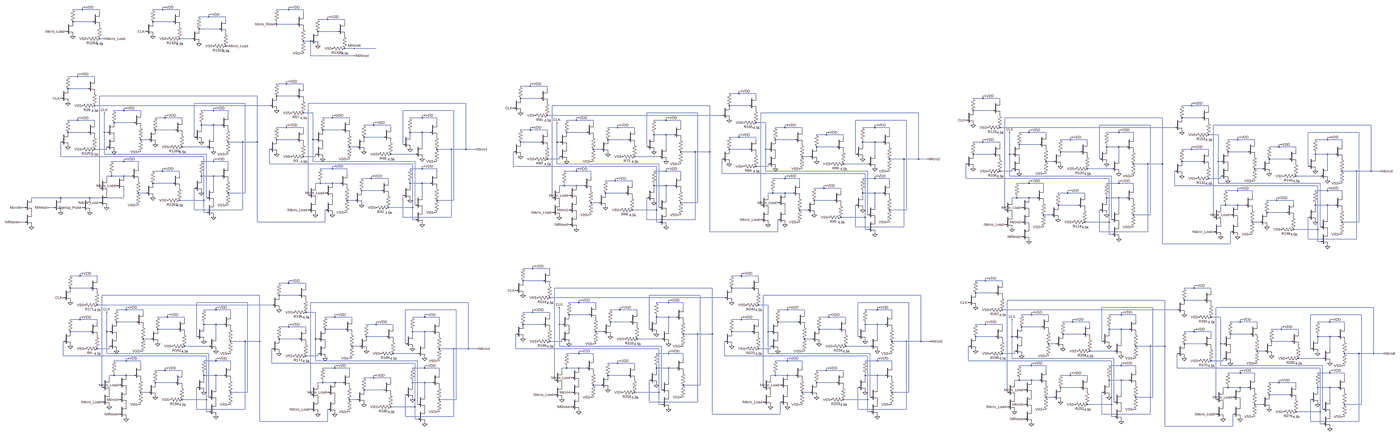
[diagram p0: schematic step_counter.asc, whole sheet]
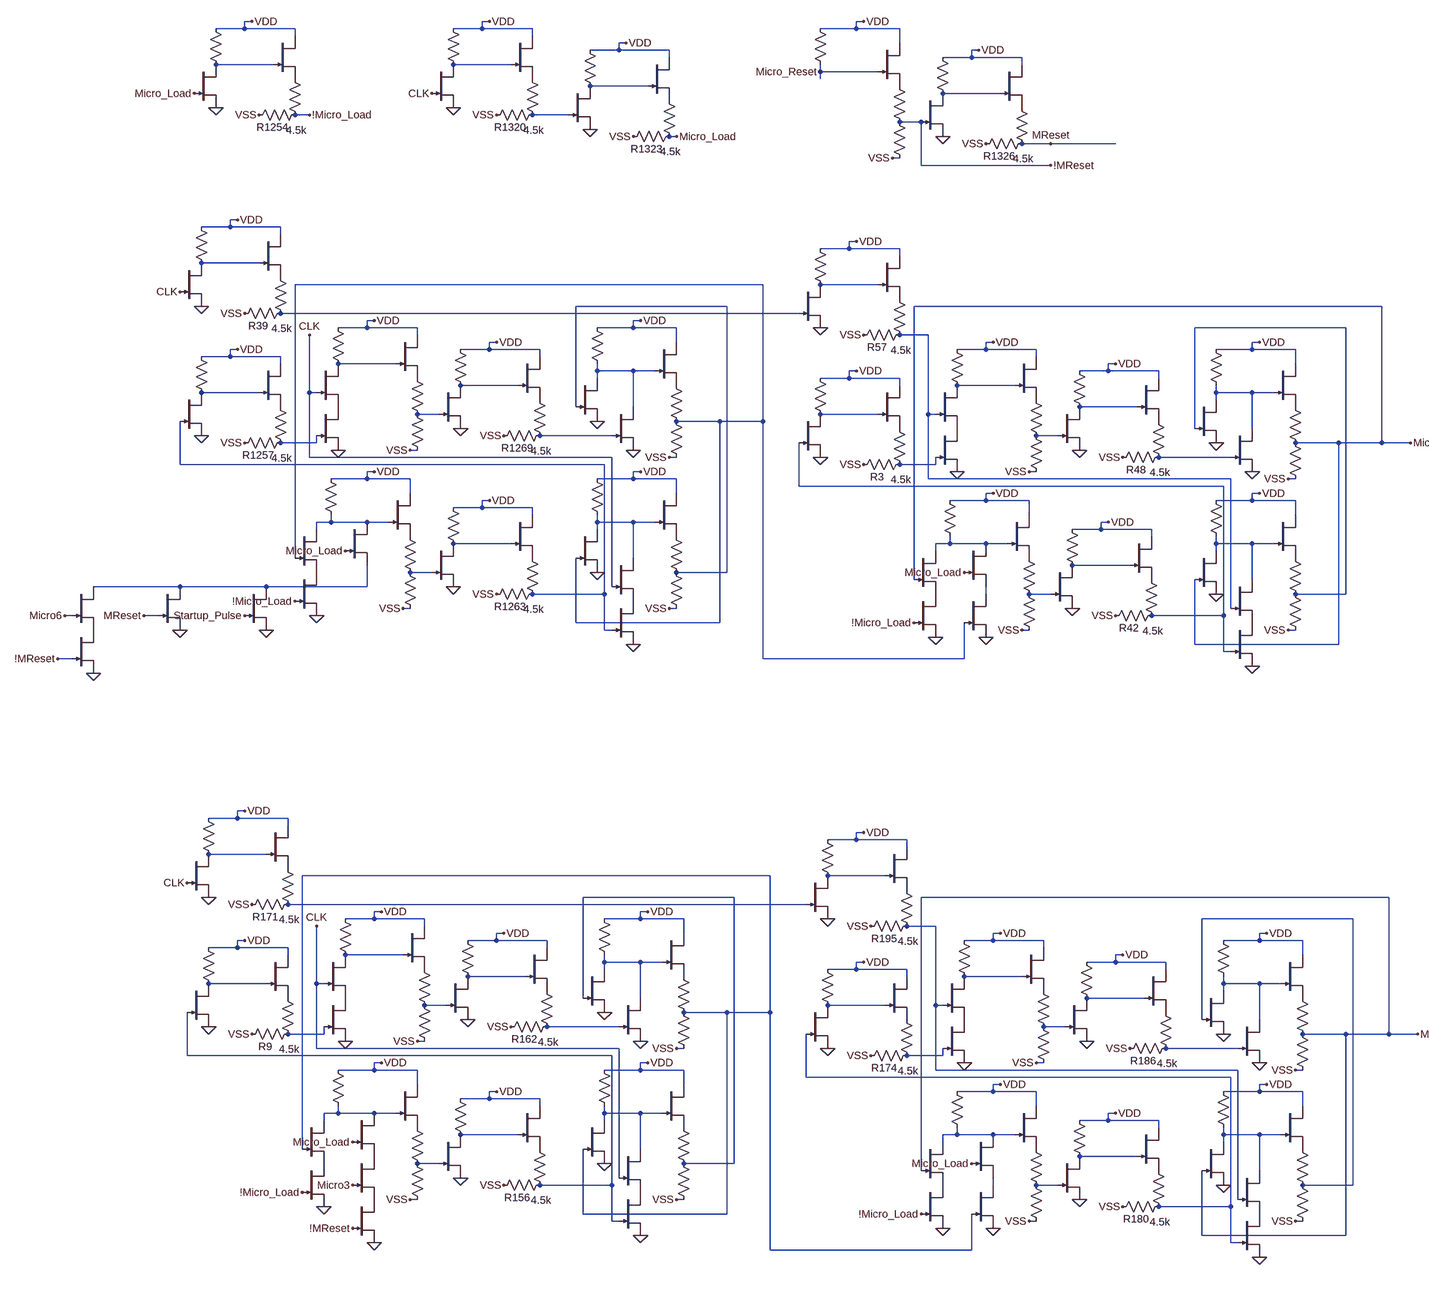
[diagram p1: schematic step_counter.asc, part, row 1 of 1, column 1 of 3]
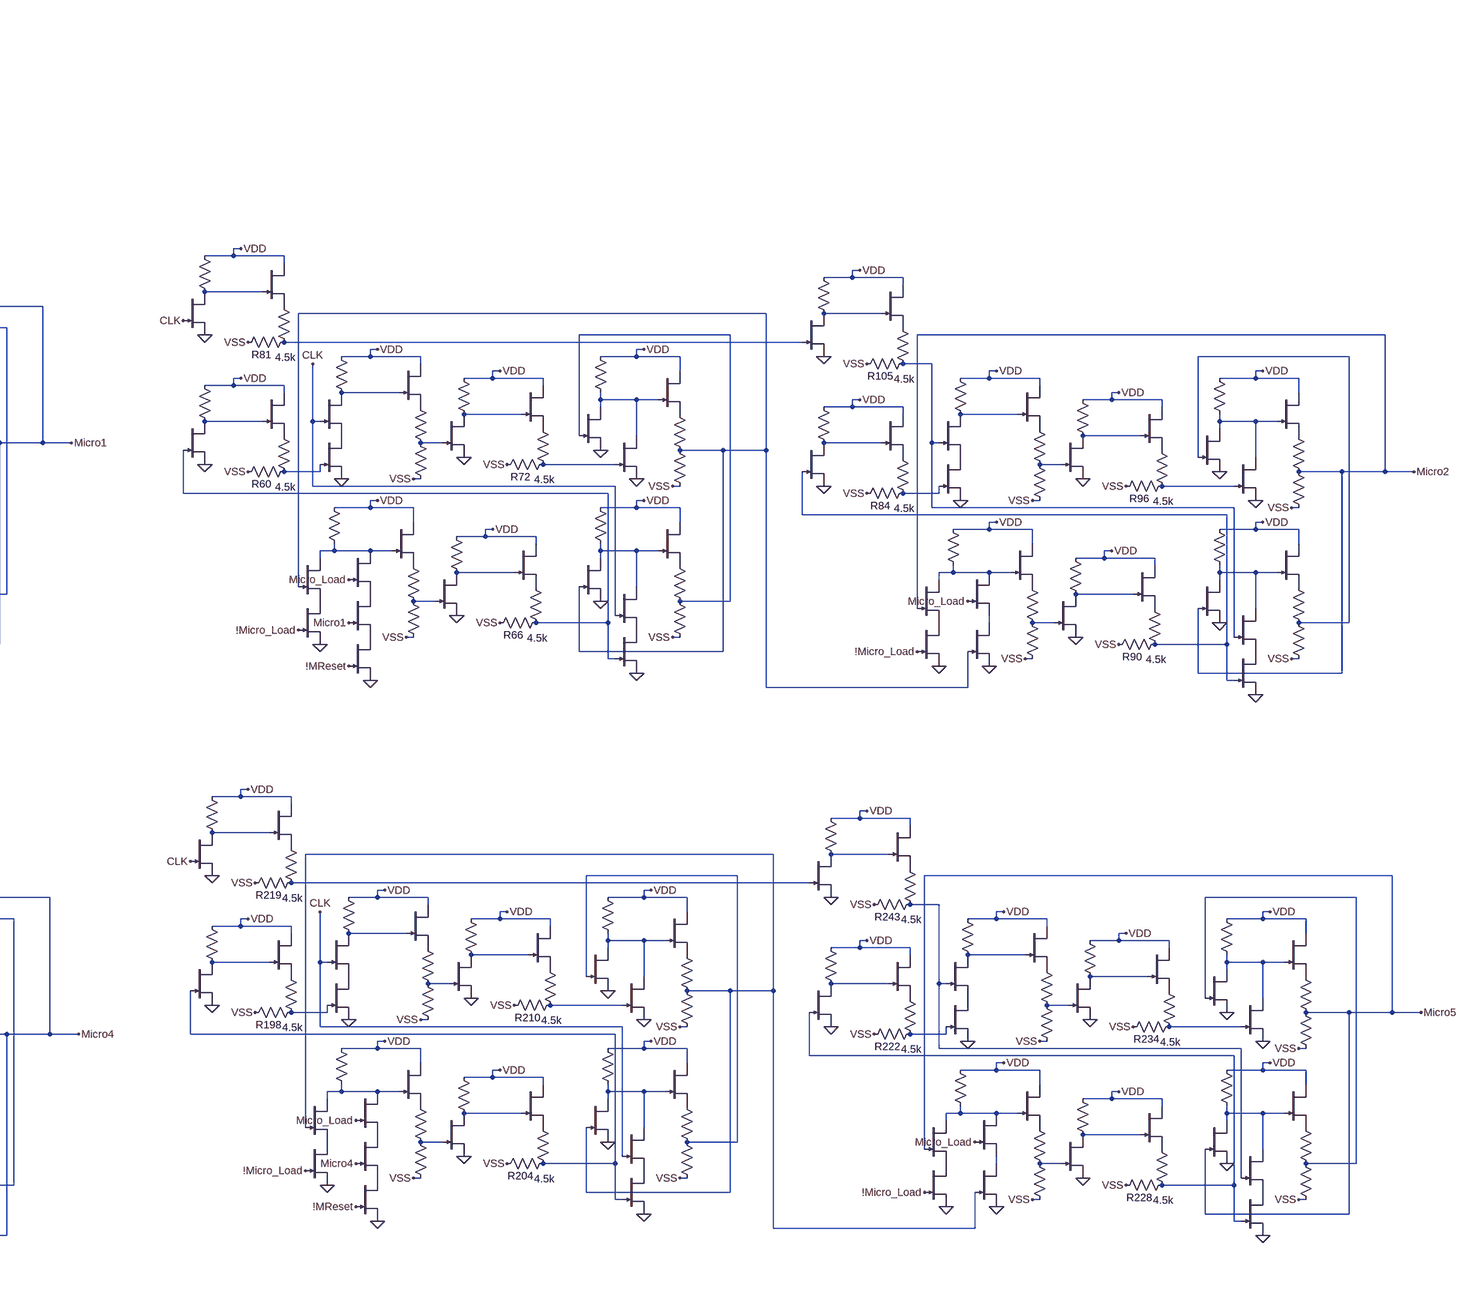
[diagram p2: schematic step_counter.asc, part, row 1 of 1, column 2 of 3]
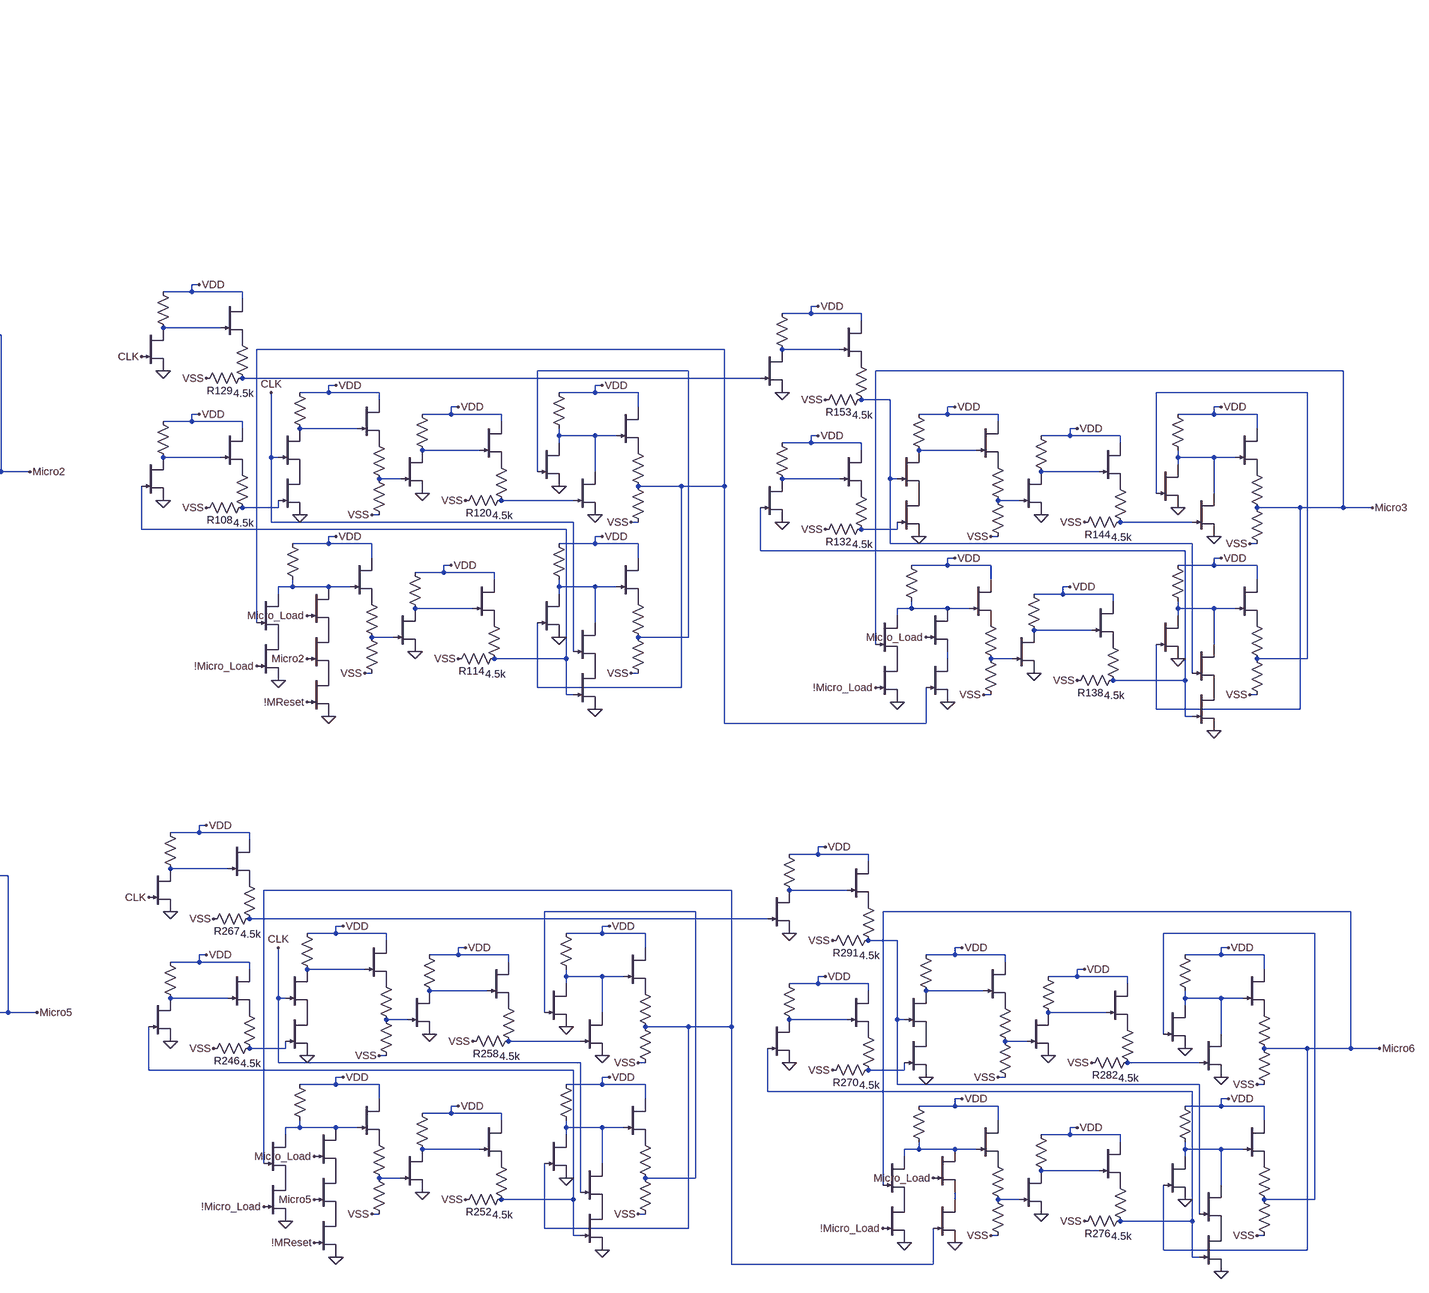
[diagram p3: schematic step_counter.asc, part, row 1 of 1, column 3 of 3]
* step_counter.asc
R1249 VDD Micro_Reset 100k
J_F313 VDD Micro_Reset P001 DR
R1250 P001 !MReset 1k
R1251 !MReset VSS 4.8k
J_A858 N001 Micro_Load 0 DR
R1252 VDD N001 50k
J_A859 VDD N001 P002 DR
R1253 P002 !Micro_Load 1k
R1254 !Micro_Load VSS 4.5k
J_A860 N071 Micro_Load N087 DR
J_A861 N029 N055 0 DR
R1255 VDD N029 50k
J_A862 VDD N029 P003 DR
R1256 P003 N047 1k
R1257 N047 VSS 4.5k
J_A863 P004 !Micro_Load 0 DR
R1258 VDD N071 100k
J_F314 VDD N071 P005 DR
R1259 P005 N083 1k
R1260 N083 VSS 4.8k
J_A864 N076 N083 0 DR
R1261 VDD N076 50k
J_A865 VDD N076 P006 DR
R1262 P006 N055 1k
R1263 N055 VSS 4.5k
J_A866 N022 CLK P007 DR
R1264 VDD N022 100k
J_F315 VDD N022 P008 DR
R1265 P008 N036 1k
R1266 N036 VSS 4.8k
J_B416 P007 N047 0 DR
J_A867 N027 N036 0 DR
R1267 VDD N027 50k
J_F316 VDD N027 P009 DR
R1268 P009 N043 1k
R1269 N043 VSS 4.5k
J_A868 N024 N010 0 DR
R1270 VDD N024 100k
J_F317 VDD N024 P010 DR
R1271 P010 N007 1k
R1272 N007 VSS 4.8k
J_B417 N024 N043 0 DR
J_A869 N072 N007 0 DR
R1273 VDD N072 100k
J_F318 VDD N072 P011 DR
R1274 P011 N010 1k
R1275 N010 VSS 4.8k
J_B418 N072 CLK P012 DR
J_A870 N071 N007 P004 DR
J_B419 P012 N055 0 DR
J_B420 N087 Startup_Pulse 0 DR
J_A871 N087 Micro6 P013 DR
J_B421 P013 !MReset 0 DR
R1318 VDD N002 50k
J_A895 VDD N002 P014 DR
R1319 P014 N005 1k
R1320 N005 VSS 4.5k
J_F329 N002 CLK 0 DR
R1321 VDD N003 50k
J_A896 VDD N003 P015 DR
R1322 P015 Micro_Load 1k
R1323 Micro_Load VSS 4.5k
J_F330 N003 N005 0 DR
J_B433 N087 MReset 0 DR
R1324 VDD N004 50k
J_A897 VDD N004 P016 DR
R1325 P016 MReset 1k
R1326 MReset VSS 4.5k
J_F331 N004 !MReset 0 DR
J_A13 N006 CLK 0 DR
R37 VDD N006 50k
J_A14 VDD N006 P017 DR
R38 P017 N011 1k
R39 N011 VSS 4.5k
J_A1 N077 Micro_Load N090 DR
J_A2 N037 N063 0 DR
R1 VDD N037 50k
J_A15 VDD N037 P018 DR
R2 P018 N056 1k
R3 N056 VSS 4.5k
J_A16 P019 !Micro_Load 0 DR
R4 VDD N077 100k
J_F1 VDD N077 P020 DR
R5 P020 N091 1k
R6 N091 VSS 4.8k
J_A17 N082 N091 0 DR
R40 VDD N082 50k
J_A18 VDD N082 P021 DR
R41 P021 N063 1k
R42 N063 VSS 4.5k
J_A19 N028 N016 P022 DR
R43 VDD N028 100k
J_F2 VDD N028 P023 DR
R44 P023 N044 1k
R45 N044 VSS 4.8k
J_B1 P022 N056 0 DR
J_A20 N035 N044 0 DR
R46 VDD N035 50k
J_F13 VDD N035 P024 DR
R47 P024 N052 1k
R48 N052 VSS 4.5k
J_A21 N030 N014 0 DR
R49 VDD N030 100k
J_F14 VDD N030 P025 DR
R50 P025 Micro1 1k
R51 Micro1 VSS 4.8k
J_B2 N030 N052 0 DR
J_A22 N078 Micro1 0 DR
R52 VDD N078 100k
J_F15 VDD N078 P026 DR
R53 P026 N014 1k
R54 N014 VSS 4.8k
J_B3 N078 N016 P027 DR
J_A23 N077 Micro1 P019 DR
J_B4 P027 N063 0 DR
J_A24 N008 N011 0 DR
R55 VDD N008 50k
J_A25 VDD N008 P028 DR
R56 P028 N016 1k
R57 N016 VSS 4.5k
J_A26 N090 N007 0 DR
J_A27 N079 Micro_Load P029 DR
J_A28 N040 N065 0 DR
R58 VDD N040 50k
J_A29 VDD N040 P030 DR
R59 P030 N059 1k
R60 N059 VSS 4.5k
J_A30 P031 !Micro_Load 0 DR
R61 VDD N079 100k
J_F16 VDD N079 P032 DR
R62 P032 N093 1k
R63 N093 VSS 4.8k
J_A31 N084 N093 0 DR
R64 VDD N084 50k
J_A32 VDD N084 P033 DR
R65 P033 N065 1k
R66 N065 VSS 4.5k
J_A33 N031 CLK P034 DR
R67 VDD N031 100k
J_F17 VDD N031 P035 DR
R68 P035 N048 1k
R69 N048 VSS 4.8k
J_B5 P034 N059 0 DR
J_A34 N038 N048 0 DR
R70 VDD N038 50k
J_F18 VDD N038 P036 DR
R71 P036 N057 1k
R72 N057 VSS 4.5k
J_A35 N033 N017 0 DR
R73 VDD N033 100k
J_F19 VDD N033 P037 DR
R74 P037 N012 1k
R75 N012 VSS 4.8k
J_B6 N033 N057 0 DR
J_A36 N080 N012 0 DR
R76 VDD N080 100k
J_F20 VDD N080 P038 DR
R77 P038 N017 1k
R78 N017 VSS 4.8k
J_B7 N080 CLK P039 DR
J_A37 N079 N012 P031 DR
J_B8 P039 N065 0 DR
J_A39 N009 CLK 0 DR
R79 VDD N009 50k
J_A40 VDD N009 P040 DR
R80 P040 N018 1k
R81 N018 VSS 4.5k
J_A41 N085 Micro_Load N097 DR
J_A42 N049 N070 0 DR
R82 VDD N049 50k
J_A43 VDD N049 P041 DR
R83 P041 N066 1k
R84 N066 VSS 4.5k
J_A44 P042 !Micro_Load 0 DR
R85 VDD N085 100k
J_F21 VDD N085 P043 DR
R86 P043 N098 1k
R87 N098 VSS 4.8k
J_A45 N092 N098 0 DR
R88 VDD N092 50k
J_A46 VDD N092 P044 DR
R89 P044 N070 1k
R90 N070 VSS 4.5k
J_A47 N039 N023 P045 DR
R91 VDD N039 100k
J_F22 VDD N039 P046 DR
R92 P046 N058 1k
R93 N058 VSS 4.8k
J_B12 P045 N066 0 DR
J_A48 N045 N058 0 DR
R94 VDD N045 50k
J_F23 VDD N045 P047 DR
R95 P047 N064 1k
R96 N064 VSS 4.5k
J_A49 N041 N021 0 DR
R97 VDD N041 100k
J_F24 VDD N041 P048 DR
R98 P048 Micro2 1k
R99 Micro2 VSS 4.8k
J_B13 N041 N064 0 DR
J_A50 N086 Micro2 0 DR
R100 VDD N086 100k
J_F25 VDD N086 P049 DR
R101 P049 N021 1k
R102 N021 VSS 4.8k
J_B14 N086 N023 P050 DR
J_A51 N085 Micro2 P042 DR
J_B15 P050 N070 0 DR
J_A52 N013 N018 0 DR
R103 VDD N013 50k
J_A53 VDD N013 P051 DR
R104 P051 N023 1k
R105 N023 VSS 4.5k
J_A54 N097 N012 0 DR
J_A55 P029 Micro1 P052 DR
J_B16 P052 !MReset 0 DR
J_A38 N088 Micro_Load P053 DR
J_A56 N053 N074 0 DR
R106 VDD N053 50k
J_A57 VDD N053 P054 DR
R107 P054 N069 1k
R108 N069 VSS 4.5k
J_A58 P055 !Micro_Load 0 DR
R109 VDD N088 100k
J_F26 VDD N088 P056 DR
R110 P056 N100 1k
R111 N100 VSS 4.8k
J_A59 N094 N100 0 DR
R112 VDD N094 50k
J_A60 VDD N094 P057 DR
R113 P057 N074 1k
R114 N074 VSS 4.5k
J_A61 N042 CLK P058 DR
R115 VDD N042 100k
J_F27 VDD N042 P059 DR
R116 P059 N061 1k
R117 N061 VSS 4.8k
J_B9 P058 N069 0 DR
J_A62 N050 N061 0 DR
R118 VDD N050 50k
J_F28 VDD N050 P060 DR
R119 P060 N067 1k
R120 N067 VSS 4.5k
J_A63 N046 N025 0 DR
R121 VDD N046 100k
J_F29 VDD N046 P061 DR
R122 P061 N019 1k
R123 N019 VSS 4.8k
J_B10 N046 N067 0 DR
J_A64 N089 N019 0 DR
R124 VDD N089 100k
J_F30 VDD N089 P062 DR
R125 P062 N025 1k
R126 N025 VSS 4.8k
J_B11 N089 CLK P063 DR
J_A65 N088 N019 P055 DR
J_B17 P063 N074 0 DR
J_A66 N015 CLK 0 DR
R127 VDD N015 50k
J_A67 VDD N015 P064 DR
R128 P064 N026 1k
R129 N026 VSS 4.5k
J_A68 N095 Micro_Load N101 DR
J_A69 N062 N081 0 DR
R130 VDD N062 50k
J_A70 VDD N062 P065 DR
R131 P065 N075 1k
R132 N075 VSS 4.5k
J_A71 P066 !Micro_Load 0 DR
R133 VDD N095 100k
J_F31 VDD N095 P067 DR
R134 P067 N102 1k
R135 N102 VSS 4.8k
J_A72 N099 N102 0 DR
R136 VDD N099 50k
J_A73 VDD N099 P068 DR
R137 P068 N081 1k
R138 N081 VSS 4.5k
J_A74 N051 N034 P069 DR
R139 VDD N051 100k
J_F32 VDD N051 P070 DR
R140 P070 N068 1k
R141 N068 VSS 4.8k
J_B18 P069 N075 0 DR
J_A75 N060 N068 0 DR
R142 VDD N060 50k
J_F33 VDD N060 P071 DR
R143 P071 N073 1k
R144 N073 VSS 4.5k
J_A76 N054 N032 0 DR
R145 VDD N054 100k
J_F34 VDD N054 P072 DR
R146 P072 Micro3 1k
R147 Micro3 VSS 4.8k
J_B19 N054 N073 0 DR
J_A77 N096 Micro3 0 DR
R148 VDD N096 100k
J_F35 VDD N096 P073 DR
R149 P073 N032 1k
R150 N032 VSS 4.8k
J_B20 N096 N034 P074 DR
J_A78 N095 Micro3 P066 DR
J_B21 P074 N081 0 DR
J_A79 N020 N026 0 DR
R151 VDD N020 50k
J_A80 VDD N020 P075 DR
R152 P075 N034 1k
R153 N034 VSS 4.5k
J_A81 N101 N019 0 DR
J_A82 P053 Micro2 P076 DR
J_B22 P076 !MReset 0 DR
J_A109 N171 Micro_Load P077 DR
J_A110 N130 N158 0 DR
R196 VDD N130 50k
J_A111 VDD N130 P078 DR
R197 P078 N150 1k
R198 N150 VSS 4.5k
J_A112 P079 !Micro_Load 0 DR
R199 VDD N171 100k
J_F44 VDD N171 P080 DR
R200 P080 N185 1k
R201 N185 VSS 4.8k
J_A113 N176 N185 0 DR
R202 VDD N176 50k
J_A114 VDD N176 P081 DR
R203 P081 N158 1k
R204 N158 VSS 4.5k
J_A115 N122 CLK P082 DR
R205 VDD N122 100k
J_F45 VDD N122 P083 DR
R206 P083 N139 1k
R207 N139 VSS 4.8k
J_B34 P082 N150 0 DR
J_A116 N127 N139 0 DR
R208 VDD N127 50k
J_F46 VDD N127 P084 DR
R209 P084 N148 1k
R210 N148 VSS 4.5k
J_A117 N124 N110 0 DR
R211 VDD N124 100k
J_F47 VDD N124 P085 DR
R212 P085 N105 1k
R213 N105 VSS 4.8k
J_B35 N124 N148 0 DR
J_A118 N172 N105 0 DR
R214 VDD N172 100k
J_F48 VDD N172 P086 DR
R215 P086 N110 1k
R216 N110 VSS 4.8k
J_B36 N172 CLK P087 DR
J_A119 N171 N105 P079 DR
J_B37 P087 N158 0 DR
J_A120 N103 CLK 0 DR
R217 VDD N103 50k
J_A121 VDD N103 P088 DR
R218 P088 N111 1k
R219 N111 VSS 4.5k
J_A122 N177 Micro_Load N191 DR
J_A123 N140 N166 0 DR
R220 VDD N140 50k
J_A124 VDD N140 P089 DR
R221 P089 N159 1k
R222 N159 VSS 4.5k
J_A125 P090 !Micro_Load 0 DR
R223 VDD N177 100k
J_F49 VDD N177 P091 DR
R224 P091 N192 1k
R225 N192 VSS 4.8k
J_A126 N184 N192 0 DR
R226 VDD N184 50k
J_A127 VDD N184 P092 DR
R227 P092 N166 1k
R228 N166 VSS 4.5k
J_A128 N128 N117 P093 DR
R229 VDD N128 100k
J_F50 VDD N128 P094 DR
R230 P094 N149 1k
R231 N149 VSS 4.8k
J_B38 P093 N159 0 DR
J_A129 N135 N149 0 DR
R232 VDD N135 50k
J_F51 VDD N135 P095 DR
R233 P095 N156 1k
R234 N156 VSS 4.5k
J_A130 N131 N115 0 DR
R235 VDD N131 100k
J_F52 VDD N131 P096 DR
R236 P096 Micro5 1k
R237 Micro5 VSS 4.8k
J_B39 N131 N156 0 DR
J_A131 N178 Micro5 0 DR
R238 VDD N178 100k
J_F53 VDD N178 P097 DR
R239 P097 N115 1k
R240 N115 VSS 4.8k
J_B40 N178 N117 P098 DR
J_A132 N177 Micro5 P090 DR
J_B41 P098 N166 0 DR
J_A133 N106 N111 0 DR
R241 VDD N106 50k
J_A134 VDD N106 P099 DR
R242 P099 N117 1k
R243 N117 VSS 4.5k
J_A135 N191 N105 0 DR
J_A136 P077 Micro4 P100 DR
J_B42 P100 !MReset 0 DR
J_A137 N179 Micro_Load P101 DR
J_A138 N144 N168 0 DR
R244 VDD N144 50k
J_A139 VDD N144 P102 DR
R245 P102 N163 1k
R246 N163 VSS 4.5k
J_A140 P103 !Micro_Load 0 DR
R247 VDD N179 100k
J_F54 VDD N179 P104 DR
R248 P104 N194 1k
R249 N194 VSS 4.8k
J_A141 N186 N194 0 DR
R250 VDD N186 50k
J_A142 VDD N186 P105 DR
R251 P105 N168 1k
R252 N168 VSS 4.5k
J_A143 N132 CLK P106 DR
R253 VDD N132 100k
J_F55 VDD N132 P107 DR
R254 P107 N152 1k
R255 N152 VSS 4.8k
J_B43 P106 N163 0 DR
J_A144 N141 N152 0 DR
R256 VDD N141 50k
J_F56 VDD N141 P108 DR
R257 P108 N160 1k
R258 N160 VSS 4.5k
J_A145 N136 N118 0 DR
R259 VDD N136 100k
J_F57 VDD N136 P109 DR
R260 P109 N112 1k
R261 N112 VSS 4.8k
J_B44 N136 N160 0 DR
J_A146 N180 N112 0 DR
R262 VDD N180 100k
J_F58 VDD N180 P110 DR
R263 P110 N118 1k
R264 N118 VSS 4.8k
J_B45 N180 CLK P111 DR
J_A147 N179 N112 P103 DR
J_B46 P111 N168 0 DR
J_A148 N107 CLK 0 DR
R265 VDD N107 50k
J_A149 VDD N107 P112 DR
R266 P112 N120 1k
R267 N120 VSS 4.5k
J_A150 N187 Micro_Load N197 DR
J_A151 N153 N173 0 DR
R268 VDD N153 50k
J_A152 VDD N153 P113 DR
R269 P113 N169 1k
R270 N169 VSS 4.5k
J_A153 P114 !Micro_Load 0 DR
R271 VDD N187 100k
J_F59 VDD N187 P115 DR
R272 P115 N198 1k
R273 N198 VSS 4.8k
J_A154 N193 N198 0 DR
R274 VDD N193 50k
J_A155 VDD N193 P116 DR
R275 P116 N173 1k
R276 N173 VSS 4.5k
J_A156 N142 N125 P117 DR
R277 VDD N142 100k
J_F60 VDD N142 P118 DR
R278 P118 N161 1k
R279 N161 VSS 4.8k
J_B47 P117 N169 0 DR
J_A157 N151 N161 0 DR
R280 VDD N151 50k
J_F61 VDD N151 P119 DR
R281 P119 N167 1k
R282 N167 VSS 4.5k
J_A158 N145 N123 0 DR
R283 VDD N145 100k
J_F62 VDD N145 P120 DR
R284 P120 Micro6 1k
R285 Micro6 VSS 4.8k
J_B48 N145 N167 0 DR
J_A159 N188 Micro6 0 DR
R286 VDD N188 100k
J_F63 VDD N188 P121 DR
R287 P121 N123 1k
R288 N123 VSS 4.8k
J_B49 N188 N125 P122 DR
J_A160 N187 Micro6 P114 DR
J_B50 P122 N173 0 DR
J_A161 N113 N120 0 DR
R289 VDD N113 50k
J_A162 VDD N113 P123 DR
R290 P123 N125 1k
R291 N125 VSS 4.5k
J_A163 N197 N112 0 DR
J_A164 P101 Micro5 P124 DR
J_B51 P124 !MReset 0 DR
J_A3 N174 Micro_Load P125 DR
J_A4 N137 N164 0 DR
R7 VDD N137 50k
J_A83 VDD N137 P126 DR
R8 P126 N157 1k
R9 N157 VSS 4.5k
J_A84 P127 !Micro_Load 0 DR
R10 VDD N174 100k
J_F3 VDD N174 P128 DR
R11 P128 N190 1k
R12 N190 VSS 4.8k
J_A85 N181 N190 0 DR
R154 VDD N181 50k
J_A86 VDD N181 P129 DR
R155 P129 N164 1k
R156 N164 VSS 4.5k
J_A87 N126 CLK P130 DR
R157 VDD N126 100k
J_F4 VDD N126 P131 DR
R158 P131 N146 1k
R159 N146 VSS 4.8k
J_B23 P130 N157 0 DR
J_A88 N133 N146 0 DR
R160 VDD N133 50k
J_F36 VDD N133 P132 DR
R161 P132 N154 1k
R162 N154 VSS 4.5k
J_A89 N129 N114 0 DR
R163 VDD N129 100k
J_F37 VDD N129 P133 DR
R164 P133 N108 1k
R165 N108 VSS 4.8k
J_B24 N129 N154 0 DR
J_A90 N175 N108 0 DR
R166 VDD N175 100k
J_F38 VDD N175 P134 DR
R167 P134 N114 1k
R168 N114 VSS 4.8k
J_B25 N175 CLK P135 DR
J_A91 N174 N108 P127 DR
J_B26 P135 N164 0 DR
J_A92 N104 CLK 0 DR
R169 VDD N104 50k
J_A93 VDD N104 P136 DR
R170 P136 N116 1k
R171 N116 VSS 4.5k
J_A94 N182 Micro_Load N195 DR
J_A95 N147 N170 0 DR
R172 VDD N147 50k
J_A96 VDD N147 P137 DR
R173 P137 N165 1k
R174 N165 VSS 4.5k
J_A97 P138 !Micro_Load 0 DR
R175 VDD N182 100k
J_F39 VDD N182 P139 DR
R176 P139 N196 1k
R177 N196 VSS 4.8k
J_A98 N189 N196 0 DR
R178 VDD N189 50k
J_A99 VDD N189 P140 DR
R179 P140 N170 1k
R180 N170 VSS 4.5k
J_A100 N134 N121 P141 DR
R181 VDD N134 100k
J_F40 VDD N134 P142 DR
R182 P142 N155 1k
R183 N155 VSS 4.8k
J_B27 P141 N165 0 DR
J_A101 N143 N155 0 DR
R184 VDD N143 50k
J_F41 VDD N143 P143 DR
R185 P143 N162 1k
R186 N162 VSS 4.5k
J_A102 N138 N119 0 DR
R187 VDD N138 100k
J_F42 VDD N138 P144 DR
R188 P144 Micro4 1k
R189 Micro4 VSS 4.8k
J_B28 N138 N162 0 DR
J_A103 N183 Micro4 0 DR
R190 VDD N183 100k
J_F43 VDD N183 P145 DR
R191 P145 N119 1k
R192 N119 VSS 4.8k
J_B29 N183 N121 P146 DR
J_A104 N182 Micro4 P138 DR
J_B30 P146 N170 0 DR
J_A105 N109 N116 0 DR
R193 VDD N109 50k
J_A106 VDD N109 P147 DR
R194 P147 N121 1k
R195 N121 VSS 4.5k
J_A107 N195 N108 0 DR
J_A108 P125 Micro3 P148 DR
J_B31 P148 !MReset 0 DR
.model NJF NJF
.model PJF PJF
.lib standard.jft
.backanno
.end